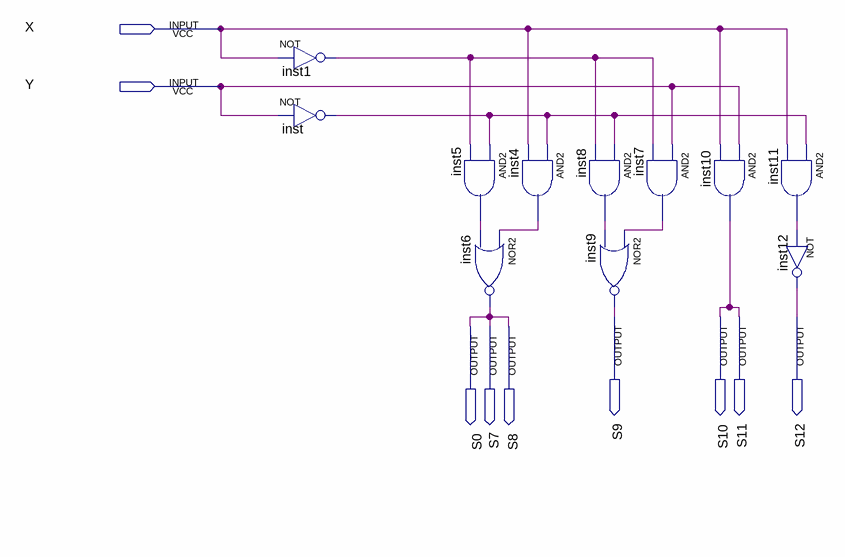
[diagram p0: schematic sheet]
// Quartus schematic circuito_base.bdf as structural Verilog: 11 symbols, 9 pins
module circuito_base (
  input  X,
  input  Y,
  output S9,
  output S10,
  output S11,
  output S12,
  output S0,
  output S7,
  output S8
);

  wire inst1_out, inst4_out, inst5_out, inst7_out, inst8_out, inst11_out, inst_out;

  not inst1 (inst1_out, X);
  not inst (inst_out, Y);
  and inst5 (inst5_out, inst_out, inst1_out);
  nor inst6 (S0, inst4_out, inst5_out);
  and inst4 (inst4_out, inst_out, X);
  and inst8 (inst8_out, inst_out, inst1_out);
  nor inst9 (S9, inst7_out, inst8_out);
  and inst7 (inst7_out, Y, inst1_out);
  and inst10 (S10, Y, X);
  and inst11 (inst11_out, inst_out, X);
  not inst12 (S12, inst11_out);

  assign S7 = S0;
  assign S8 = S0;
  assign S11 = S10;
endmodule
